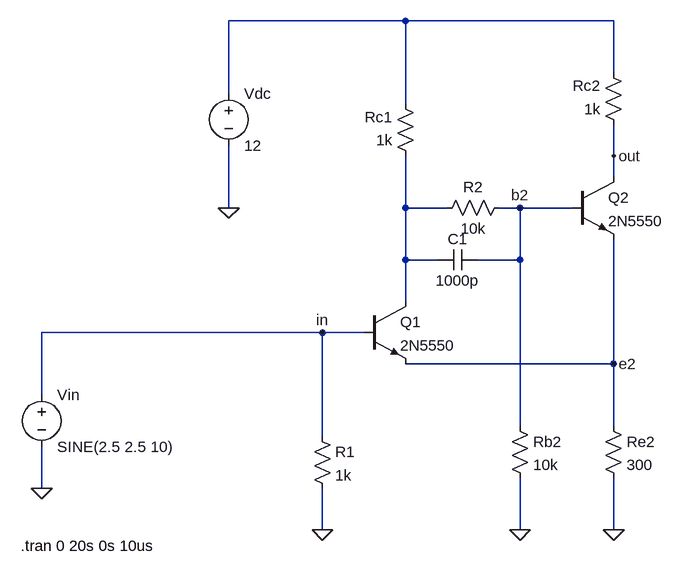
[diagram p0: schematic Bistable.asc]
Bistable.asc, the LTspice schematic file:
Version 4
SHEET 1 880 680
WIRE 160 -320 -112 -320
WIRE 480 -320 160 -320
WIRE 480 -240 480 -320
WIRE -112 -208 -112 -320
WIRE 160 -192 160 -320
WIRE 480 -112 480 -160
WIRE 480 -80 480 -112
WIRE -112 -32 -112 -128
WIRE 160 -32 160 -112
WIRE 224 -32 160 -32
WIRE 336 -32 304 -32
WIRE 416 -32 336 -32
WIRE 160 48 160 -32
WIRE 208 48 160 48
WIRE 336 48 336 -32
WIRE 336 48 272 48
WIRE 160 112 160 48
WIRE 32 160 -400 160
WIRE 96 160 32 160
WIRE 480 208 480 16
WIRE 480 208 160 208
WIRE -400 256 -400 160
WIRE 336 304 336 48
WIRE 480 304 480 208
WIRE 32 320 32 160
WIRE -400 400 -400 336
WIRE 32 464 32 400
WIRE 336 464 336 384
WIRE 480 464 480 384
FLAG 336 464 0
FLAG 480 464 0
FLAG 32 464 0
FLAG -400 400 0
FLAG -112 -32 0
FLAG 32 160 in
FLAG 480 -112 out
FLAG 336 -32 b2
FLAG 480 208 e2
SYMBOL npn 96 112 R0
SYMATTR InstName Q1
SYMATTR Value 2N5550
SYMBOL npn 416 -80 R0
SYMATTR InstName Q2
SYMATTR Value 2N5550
SYMBOL res 464 288 R0
SYMATTR InstName Re2
SYMATTR Value 300
SYMBOL res 320 288 R0
SYMATTR InstName Rb2
SYMATTR Value 10k
SYMBOL res 320 -48 R90
WINDOW 0 0 56 VBottom 2
WINDOW 3 32 56 VTop 2
SYMATTR InstName R2
SYMATTR Value 10k
SYMBOL res 176 -96 R180
WINDOW 0 36 76 Left 2
WINDOW 3 36 40 Left 2
SYMATTR InstName Rc1
SYMATTR Value 1k
SYMBOL res 496 -144 R180
WINDOW 0 36 76 Left 2
WINDOW 3 36 40 Left 2
SYMATTR InstName Rc2
SYMATTR Value 1k
SYMBOL res 16 304 R0
SYMATTR InstName R1
SYMATTR Value 1k
SYMBOL voltage -400 240 R0
WINDOW 123 0 0 Left 2
WINDOW 39 0 0 Left 2
SYMATTR InstName Vin
SYMATTR Value SINE(2.5 2.5 10)
SYMBOL voltage -112 -224 R0
WINDOW 123 0 0 Left 2
WINDOW 39 0 0 Left 2
SYMATTR InstName Vdc
SYMATTR Value 12
SYMBOL cap 272 32 R90
WINDOW 0 0 32 VBottom 2
WINDOW 3 32 32 VTop 2
SYMATTR InstName C1
SYMATTR Value 1000p
TEXT -432 488 Left 2 !.tran 0 20s 0s 10us

The netlist it stands for:
* Bistable.asc
Q1 N002 in e2 0 2N5550
Q2 out b2 e2 0 2N5550
Re2 e2 0 300
Rb2 b2 0 10k
R2 b2 N002 10k
Rc1 N002 N001 1k
Rc2 out N001 1k
R1 in 0 1k
Vin in 0 SINE(2.5 2.5 10)
Vdc N001 0 12
C1 b2 N002 1000p
.model NPN NPN
.model PNP PNP
.lib standard.bjt
.tran 0 20s 0s 10us
.backanno
.end